# Altium schematic sheet Microcontroller.SchDoc
size A3
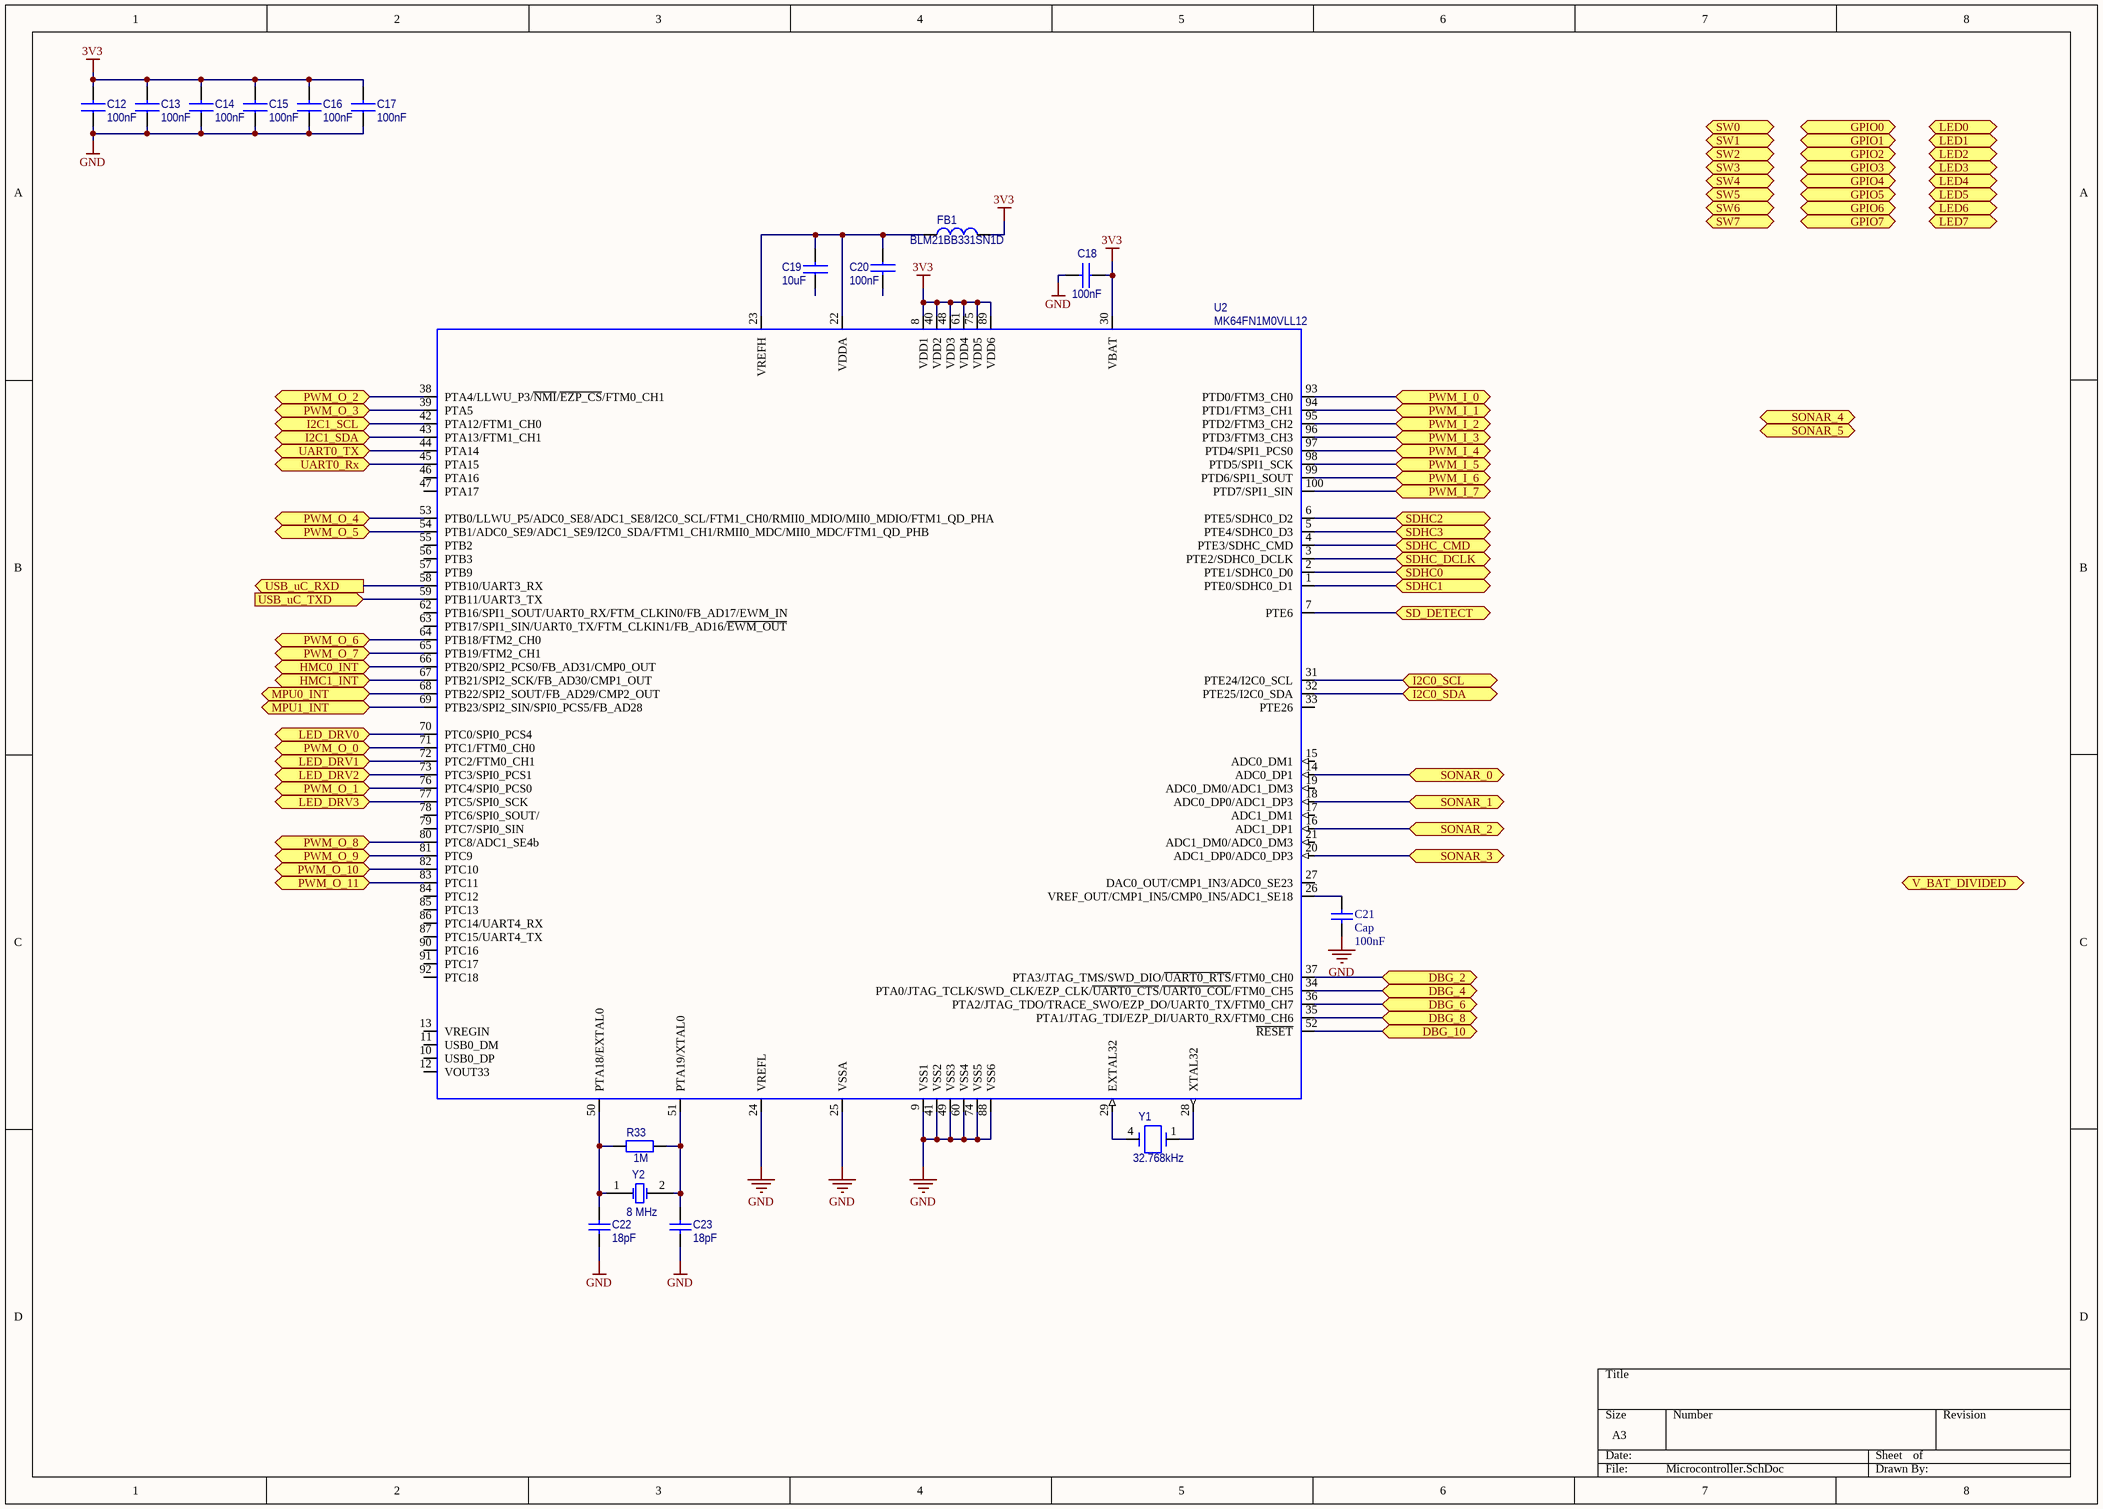
[diagram p0: Microcontroller.SchDoc]

## Parts
C12  100nF  [060301]
C13  100nF  [060301]
C14  100nF  [060301]
C15  100nF  [060301]
C16  100nF  [060301]
C17  100nF  [060301]
C18  100nF  [060301]
C19  value 10uF  [060301]  (hidden comment: C1608X5R1A106K080AC)
C20  100nF  [060301]
C21  Cap  value 100nF  [RAD-0.3]
C22  18pF  [060301]
C23  18pF  [060301]
FB1  BLM21BB331SN1D  [080501]
R33  1M  [060301]
U2  MK64FN1M0VLL12  [LQFP100_0P5_14X14]
Y1  value 32.768kHz  [XT-5]  (hidden comment: ECS-.327-12.5-17X-C-TR)
Y2  value 8 MHz  [XT8_2-SMD]  (hidden comment: ABM3-8.000MHZ-D2Y-T)

## Ports
DBG_2, DBG_4, DBG_6, DBG_8, DBG_10, GPIO0, GPIO1, GPIO2, GPIO3, GPIO4, GPIO5, GPIO6, GPIO7, HMC0_INT, HMC1_INT, I2C0_SCL, I2C0_SDA, I2C1_SCL, I2C1_SDA, LED0 (in), LED1 (in), LED2 (in), LED3 (in), LED4 (in), LED5 (in), LED6 (in), LED7 (in), LED_DRV0, LED_DRV1, LED_DRV2, LED_DRV3, MPU0_INT, MPU1_INT, PWM_I_0, PWM_I_1, PWM_I_2, PWM_I_3, PWM_I_4, PWM_I_5, PWM_I_6, PWM_I_7, PWM_O_0, PWM_O_1, PWM_O_2, PWM_O_3, PWM_O_4, PWM_O_5, PWM_O_6, PWM_O_7, PWM_O_8, PWM_O_9, PWM_O_10, PWM_O_11, SD_DETECT, SDHC0, SDHC1, SDHC2, SDHC3, SDHC_CMD, SDHC_DCLK, SONAR_0, SONAR_1, SONAR_2, SONAR_3, SONAR_4, SONAR_5, SW0 (out), SW1 (out), SW2 (out), SW3 (out), SW4 (out), SW5 (out), SW6 (out), SW7 (out), UART0_Rx, UART0_TX, USB_uC_RXD (out), USB_uC_TXD (in), V_BAT_DIVIDED

## Nets
3V3: C12.2 C13.2 C14.2 C15.2 C16.2 C17.2 C18.1 FB1.2 U2.8(VDD1) U2.30(VBAT) U2.40(VDD2) U2.48(VDD3) U2.61(VDD4) U2.75(VDD5) U2.89(VDD6)
GND: C12.1 C13.1 C14.1 C15.1 C16.1 C17.1 C18.2 C21.1 C22.1 C23.1 U2.9(VSS1) U2.24(VREFL) U2.25(VSSA) U2.41(VSS2) U2.49(VSS3) U2.60(VSS4) U2.74(VSS5) U2.88(VSS6)
DBG_2: U2.37(PTA3/JTAG_TMS/SWD_DIO/~{UART0_RTS}/FTM0_CH0) ; port DBG_2
DBG_4: U2.34(PTA0/JTAG_TCLK/SWD_CLK/EZP_CLK/~{UART0_CTS}/~{UART0_COL}/FTM0_CH5) ; port DBG_4
DBG_6: U2.36(PTA2/JTAG_TDO/TRACE_SWO/EZP_DO/UART0_TX/FTM0_CH7) ; port DBG_6
DBG_8: U2.35(PTA1/JTAG_TDI/EZP_DI/UART0_RX/FTM0_CH6) ; port DBG_8
DBG_10: U2.52(~{RESET}) ; port DBG_10
HMC0_INT: U2.66(PTB20/SPI2_PCS0/FB_AD31/CMP0_OUT) ; port HMC0_INT
HMC1_INT: U2.67(PTB21/SPI2_SCK/FB_AD30/CMP1_OUT) ; port HMC1_INT
I2C0_SCL: U2.31(PTE24/I2C0_SCL) ; port I2C0_SCL
I2C0_SDA: U2.32(PTE25/I2C0_SDA) ; port I2C0_SDA
I2C1_SCL: U2.42(PTA12/FTM1_CH0) ; port I2C1_SCL
I2C1_SDA: U2.43(PTA13/FTM1_CH1) ; port I2C1_SDA
LED_DRV0: U2.70(PTC0/SPI0_PCS4) ; port LED_DRV0
LED_DRV1: U2.72(PTC2/FTM0_CH1) ; port LED_DRV1
LED_DRV2: U2.73(PTC3/SPI0_PCS1) ; port LED_DRV2
LED_DRV3: U2.77(PTC5/SPI0_SCK) ; port LED_DRV3
MPU0_INT: U2.68(PTB22/SPI2_SOUT/FB_AD29/CMP2_OUT) ; port MPU0_INT
MPU1_INT: U2.69(PTB23/SPI2_SIN/SPI0_PCS5/FB_AD28) ; port MPU1_INT
PWM_I_0: U2.93(PTD0/FTM3_CH0) ; port PWM_I_0
PWM_I_1: U2.94(PTD1/FTM3_CH1) ; port PWM_I_1
PWM_I_2: U2.95(PTD2/FTM3_CH2) ; port PWM_I_2
PWM_I_3: U2.96(PTD3/FTM3_CH3) ; port PWM_I_3
PWM_I_4: U2.97(PTD4/SPI1_PCS0) ; port PWM_I_4
PWM_I_5: U2.98(PTD5/SPI1_SCK) ; port PWM_I_5
PWM_I_6: U2.99(PTD6/SPI1_SOUT) ; port PWM_I_6
PWM_I_7: U2.100(PTD7/SPI1_SIN) ; port PWM_I_7
PWM_O_0: U2.71(PTC1/FTM0_CH0) ; port PWM_O_0
PWM_O_1: U2.76(PTC4/SPI0_PCS0) ; port PWM_O_1
PWM_O_2: U2.38(PTA4/LLWU_P3/~{NMI}/~{EZP_CS}/FTM0_CH1) ; port PWM_O_2
PWM_O_3: U2.39(PTA5) ; port PWM_O_3
PWM_O_4: U2.53(PTB0/LLWU_P5/ADC0_SE8/ADC1_SE8/I2C0_SCL/FTM1_CH0/RMII0_MDIO/MII0_MDIO/FTM1_QD_PHA) ; port PWM_O_4
PWM_O_5: U2.54(PTB1/ADC0_SE9/ADC1_SE9/I2C0_SDA/FTM1_CH1/RMII0_MDC/MII0_MDC/FTM1_QD_PHB) ; port PWM_O_5
PWM_O_6: U2.64(PTB18/FTM2_CH0) ; port PWM_O_6
PWM_O_7: U2.65(PTB19/FTM2_CH1) ; port PWM_O_7
PWM_O_8: U2.80(PTC8/ADC1_SE4b) ; port PWM_O_8
PWM_O_9: U2.81(PTC9) ; port PWM_O_9
PWM_O_10: U2.82(PTC10) ; port PWM_O_10
PWM_O_11: U2.83(PTC11) ; port PWM_O_11
SD_DETECT: U2.7(PTE6) ; port SD_DETECT
SDHC0: U2.2(PTE1/SDHC0_D0) ; port SDHC0
SDHC1: U2.1(PTE0/SDHC0_D1) ; port SDHC1
SDHC2: U2.6(PTE5/SDHC0_D2) ; port SDHC2
SDHC3: U2.5(PTE4/SDHC0_D3) ; port SDHC3
SDHC_CMD: U2.4(PTE3/SDHC_CMD) ; port SDHC_CMD
SDHC_DCLK: U2.3(PTE2/SDHC0_DCLK) ; port SDHC_DCLK
SONAR_0: U2.14(ADC0_DP1) ; port SONAR_0
SONAR_1: U2.18(ADC0_DP0/ADC1_DP3) ; port SONAR_1
SONAR_2: U2.16(ADC1_DP1) ; port SONAR_2
SONAR_3: U2.20(ADC1_DP0/ADC0_DP3) ; port SONAR_3
UART0_Rx: U2.45(PTA15) ; port UART0_Rx
UART0_TX: U2.44(PTA14) ; port UART0_TX
USB_uC_RXD: U2.58(PTB10/UART3_RX) ; port USB_uC_RXD
USB_uC_TXD: U2.59(PTB11/UART3_TX) ; port USB_uC_TXD
NetC19_2: C19.2 C20.1 FB1.1 U2.22(VDDA) U2.23(VREFH)
NetC21_2: C21.2 U2.26(VREF_OUT/CMP1_IN5/CMP0_IN5/ADC1_SE18)
NetC22_2: C22.2 R33.1 U2.50(PTA18/EXTAL0) Y2.1(OSC1)
NetC23_2: C23.2 R33.2 U2.51(PTA19/XTAL0) Y2.2(OSC2)
NetU2_28: U2.28(XTAL32) Y1.1
NetU2_29: U2.29(EXTAL32) Y1.4

Not connected (* = marked no-connect by the designer): C19 1; C20 2; U2 10(USB0_DP) 11(USB0_DM) 12(VOUT33) 13(VREGIN) 15(ADC0_DM1) 17(ADC1_DM1) 19(ADC0_DM0/ADC1_DM3) 21(ADC1_DM0/ADC0_DM3) 27(DAC0_OUT/CMP1_IN3/ADC0_SE23) 33(PTE26) 46(PTA16) 47(PTA17) 55(PTB2) 56(PTB3) 57(PTB9) 62(PTB16/SPI1_SOUT/UART0_RX/FTM_CLKIN0/FB_AD17/EWM_IN) 63(PTB17/SPI1_SIN/UART0_TX/FTM_CLKIN1/FB_AD16/~{EWM_OUT}) 78(PTC6/SPI0_SOUT/) 79(PTC7/SPI0_SIN) 84(PTC12) 85(PTC13) 86(PTC14/UART4_RX) 87(PTC15/UART4_TX) 90(PTC16) 91(PTC17) 92(PTC18)

## Library data of the parts
C12-C18 C20 = CAPA: CAP CER 0.1UF 25V 10% X7R 0603; Value: 100nF; Supplier 1: Digi-Key; Supplier Part Number 1: 445-1316-1-ND; Voltage: 25V
C19 = CAPA: CAP CER 10UF 10V 10% X5R 0603; Supplier 1: Digi-Key; Supplier Part Number 1: 445-7486-6-ND; Voltage: 10V
C21 = CAP: Capacitor; Published: 8-Jun-2000; LatestRevisionDate: 17-Jul-2002; LatestRevisionNote: Re-released for DXP Platform.; PackageReference: RAD-0.3; Publisher: Altium Limited; PackageDescription: Radial Cap, Thru-Hole; 2 Leads; 0.3 in Pin Spacing
C22 C23 = Cap Semi: CAP CER 18PF 50V 5% NP0 0603; Value: 18pF; Supplier 1: Digi-Key; Supplier Part Number 1: 399-1052-6-ND
FB1 = Ferrite Bead: EMI Filter Beads, Chips & Arrays 0805 330 OHM; Value: 300R@100MHz; Supplier 1: Mouser; Supplier Part Number 1: 81-BLM21BB331SN1D
R33 = RES: RES 1.00M OHM 1/10W 1% 0603 SMD; Value: 1M; Supplier 1: Digi-Key; Supplier Part Number 1: 311-1.00MHRCT-ND
U2 = K64FN1M0VLL12_100P: IC MCU 1MB FLASH 120MHZ 1.71-3.6V LQFP100; Supplier 1: Digi-Key; Supplier Part Number 1: MK64FN1M0VLL12-ND
Y1 = Crystal_32: CRYSTAL 32.768 KHZ 12.5PF SMD; Supplier 1: Digi-Key; Supplier Part Number 1: XC1912CT-ND
Y2 = XTAL: CRYSTAL 8MHZ 18PF SMD; Supplier 1: Digi-Key; Supplier Part Number 1: 535-10630-6-ND